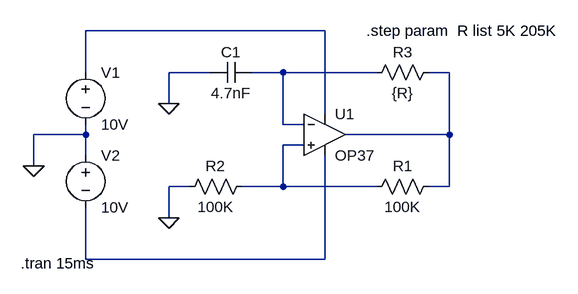
[diagram p0: schematic relaxation_osc.asc]
relaxation_osc.asc, the LTspice schematic file:
Version 4
SHEET 1 880 680
WIRE 192 -16 -176 -16
WIRE -176 48 -176 -16
WIRE 16 48 -48 48
WIRE 128 48 80 48
WIRE 272 48 128 48
WIRE 384 48 352 48
WIRE -48 96 -48 48
WIRE 192 112 192 -16
WIRE 128 128 128 48
WIRE 160 128 128 128
WIRE -176 144 -176 128
WIRE -176 144 -256 144
WIRE 384 144 384 48
WIRE 384 144 224 144
WIRE 160 160 128 160
WIRE -176 176 -176 144
WIRE -256 192 -256 144
WIRE -16 224 -48 224
WIRE 128 224 128 160
WIRE 128 224 64 224
WIRE 272 224 128 224
WIRE 384 224 384 144
WIRE 384 224 352 224
WIRE -48 272 -48 224
WIRE -176 336 -176 256
WIRE 192 336 192 176
WIRE 192 336 -176 336
FLAG -48 272 0
FLAG -48 96 0
FLAG -256 192 0
SYMBOL res 368 208 R90
WINDOW 0 0 56 VBottom 2
WINDOW 3 32 56 VTop 2
SYMATTR InstName R1
SYMATTR Value 100K
SYMBOL res 80 208 R90
WINDOW 0 0 56 VBottom 2
WINDOW 3 32 56 VTop 2
SYMATTR InstName R2
SYMATTR Value 100K
SYMBOL res 368 32 R90
WINDOW 0 0 56 VBottom 2
WINDOW 3 32 56 VTop 2
SYMATTR InstName R3
SYMATTR Value {R}
SYMBOL cap 80 32 R90
WINDOW 0 0 32 VBottom 2
WINDOW 3 32 32 VTop 2
SYMATTR InstName C1
SYMATTR Value 4.7nF
SYMBOL voltage -176 32 R0
WINDOW 123 0 0 Left 2
WINDOW 39 0 0 Left 2
SYMATTR InstName V1
SYMATTR Value 10V
SYMBOL voltage -176 160 R0
WINDOW 123 0 0 Left 2
WINDOW 39 0 0 Left 2
SYMATTR InstName V2
SYMATTR Value 10V
SYMBOL Opamps\\OP37 192 80 R0
SYMATTR InstName U1
TEXT 256 -16 Left 2 !.step param  R list 5K 205K
TEXT -276 342 Left 2 !.tran 15ms

The netlist it stands for:
* relaxation_osc.asc
R1 N003 N004 100K
R2 N004 0 100K
R3 N003 N002 {R}
C1 N002 0 4.7nF
V1 N001 0 10V
V2 0 N005 10V
XU1 N004 N002 N001 N005 N003 LT1037  ; OP37, pins In+ In- V+ V- OUT
.step param  R list 5K 205K
.tran 15ms
.lib LTC.lib
.backanno
.end